# EAGLE design sub_board (EAGLE 7.3.0)
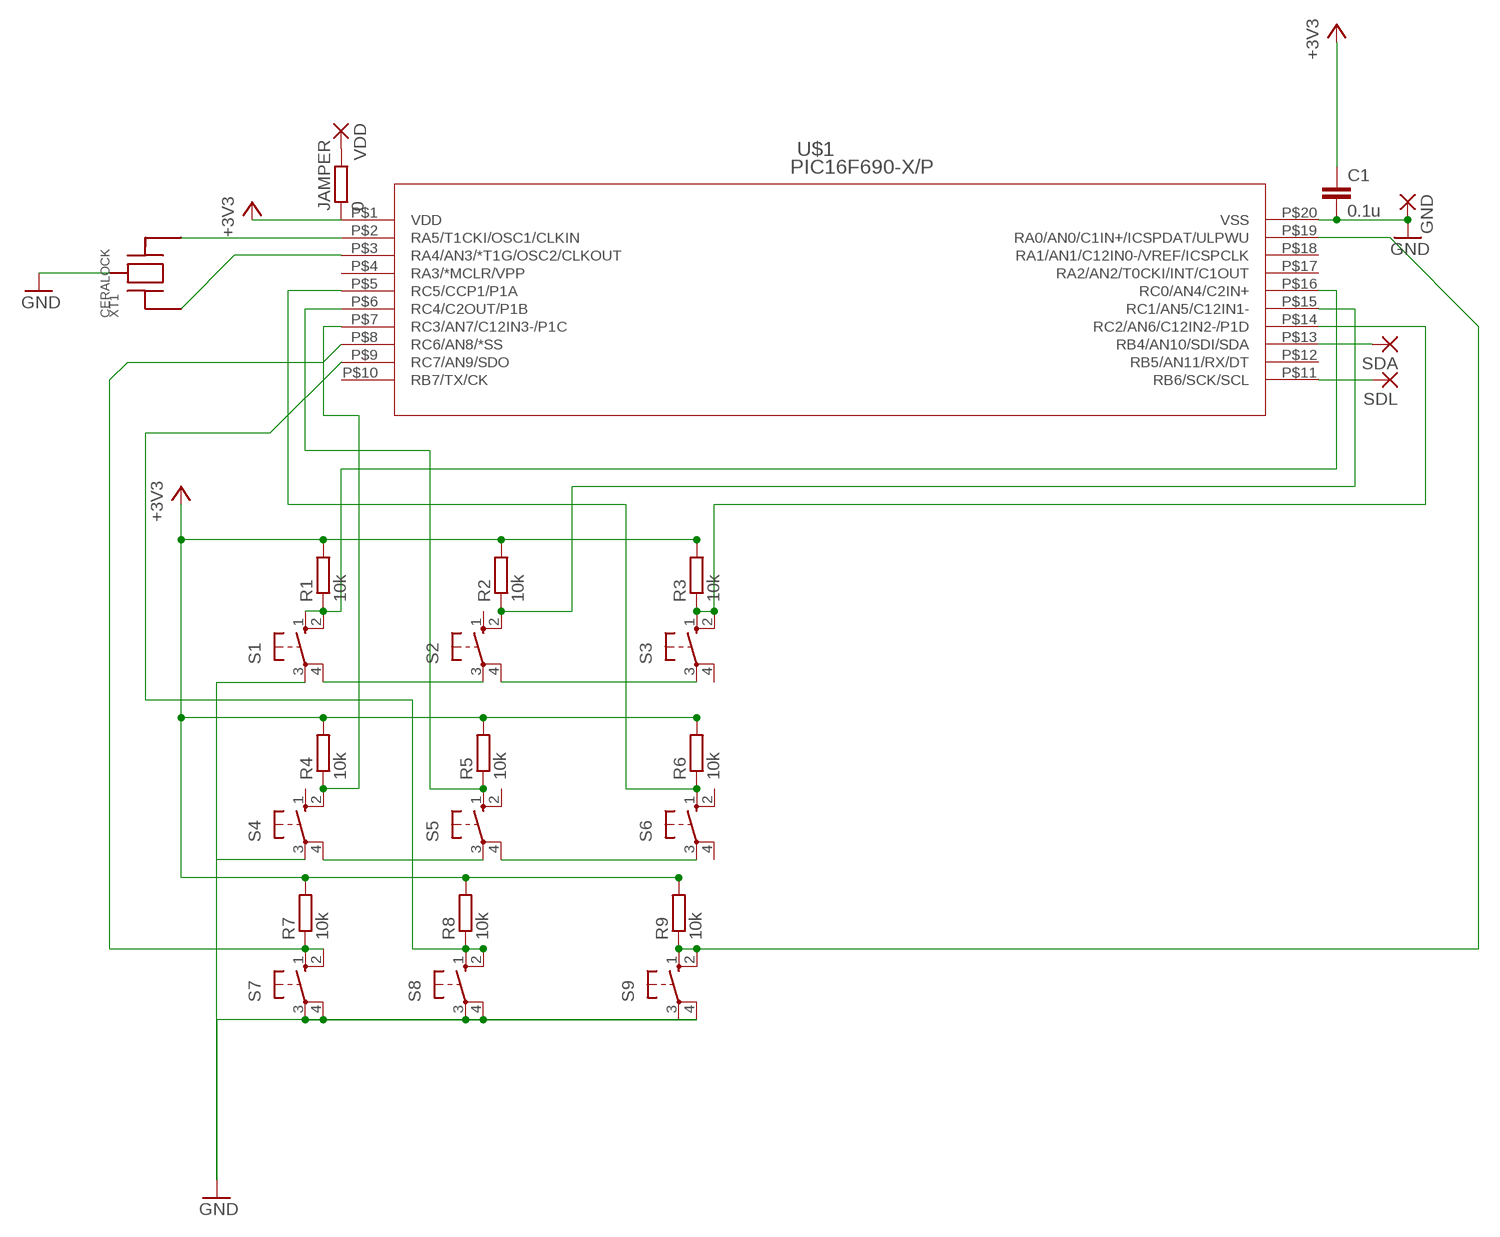
[diagram p0: schematic, sheet 1]

## Parts
C1  0.1u  C-EU025-024X044  [C025-024X044]
GND  2,15/1,0  [2,15/1,0]
JAMPER  0  R-EU_0207/10  [0207/10]
R1  10k  R-EU_0204/7  [0204/7]
R2  10k  R-EU_0204/7  [0204/7]
R3  10k  R-EU_0204/7  [0204/7]
R4  10k  R-EU_0204/7  [0204/7]
R5  10k  R-EU_0204/7  [0204/7]
R6  10k  R-EU_0204/7  [0204/7]
R7  10k  R-EU_0204/7  [0204/7]
R8  10k  R-EU_0204/7  [0204/7]
R9  10k  R-EU_0204/7  [0204/7]
S1  10-XX  [B3F-10XX]
S2  10-XX  [B3F-10XX]
S3  10-XX  [B3F-10XX]
S4  10-XX  [B3F-10XX]
S5  10-XX  [B3F-10XX]
S6  10-XX  [B3F-10XX]
S7  10-XX  [B3F-10XX]
S8  10-XX  [B3F-10XX]
S9  10-XX  [B3F-10XX]
SDA  2,15/1,0  [2,15/1,0]
SDL  2,15/1,0  [2,15/1,0]
U$1  PIC16F690-X/P  [PDIP20_300MC]
VDD  2,15/1,0  [2,15/1,0]
XT1  CERALOCK  [CERALOCK]

## Nets
+3V3: C1.1 JAMPER.1 R1.2 R2.2 R3.2 R4.2 R5.2 R6.2 R7.2 R8.2 R9.2 U$1.P$1(VDD)
GND: C1.2 GND.1(P) S1.3(P) S4.3(P) S7.3(P) S7.4(P1) S8.3(P) S8.4(P1) S9.3(P) S9.4(P1) U$1.P$20(VSS) XT1.P$2
N$1: R1.1 S1.1(S) S1.2(S1) U$1.P$16(RC0/AN4/C2IN+)
N$2: R5.1 S5.1(S) U$1.P$6(RC4/C2OUT/P1B)
N$3: JAMPER.2 VDD.1(P)
N$4: R8.1 S8.1(S) S8.2(S1) U$1.P$9(RC7/AN9/SDO)
N$5: R2.1 S2.2(S1) U$1.P$15(RC1/AN5/C12IN1-)
N$6: R3.1 S3.1(S) S3.2(S1) U$1.P$14(RC2/AN6/C12IN2-/P1D)
N$7: S4.4(P1) S5.3(P)
N$8: S5.4(P1) S6.3(P)
N$9: S1.4(P1) S2.3(P)
N$10: R6.1 S6.1(S) U$1.P$5(RC5/CCP1/P1A)
N$12: S2.4(P1) S3.3(P)
N$13: U$1.P$3(RA4/AN3/*T1G/OSC2/CLKOUT) XT1.P$1
N$14: U$1.P$2(RA5/T1CKI/OSC1/CLKIN) XT1.P$3
N$15: SDA.1(P) U$1.P$13(RB4/AN10/SDI/SDA)
N$16: SDL.1(P) U$1.P$11(RB6/SCK/SCL)
N$17: R4.1 S4.2(S1) U$1.P$7(RC3/AN7/C12IN3-/P1C)
N$26: R9.1 S9.1(S) S9.2(S1) U$1.P$19(RA0/AN0/C1IN+/ICSPDAT/ULPWU)
N$27: R7.1 S7.1(S) S7.2(S1) U$1.P$8(RC6/AN8/*SS)
Unconnected: S2.1(S) S3.4(P1) S4.1(S) S5.2(S1) S6.2(S1) S6.4(P1) U$1.P$4(RA3/*MCLR/VPP) U$1.P$10(RB7/TX/CK) U$1.P$12(RB5/AN11/RX/DT) U$1.P$17(RA2/AN2/T0CKI/INT/C1OUT) U$1.P$18(RA1/AN1/C12IN0-/VREF/ICSPCLK)

## Library data of the parts
C1 = rcl:C-EU: CAPACITOR, European symbol
GND SDA SDL VDD = wirepad:2,15/1,0: THROUGH-HOLE PAD
JAMPER R1-R9 = rcl:R-EU_: RESISTOR, European symbol
S1-S9 = switch-omron:10-XX: OMRON SWITCH; MPN: B3F-1000; OC_FARNELL: 176432; OC_NEWARK: 36M3542
U$1 = pic16f690_p:PIC16F690-X/P
XT1 = serolock:CERALOCK

## Board
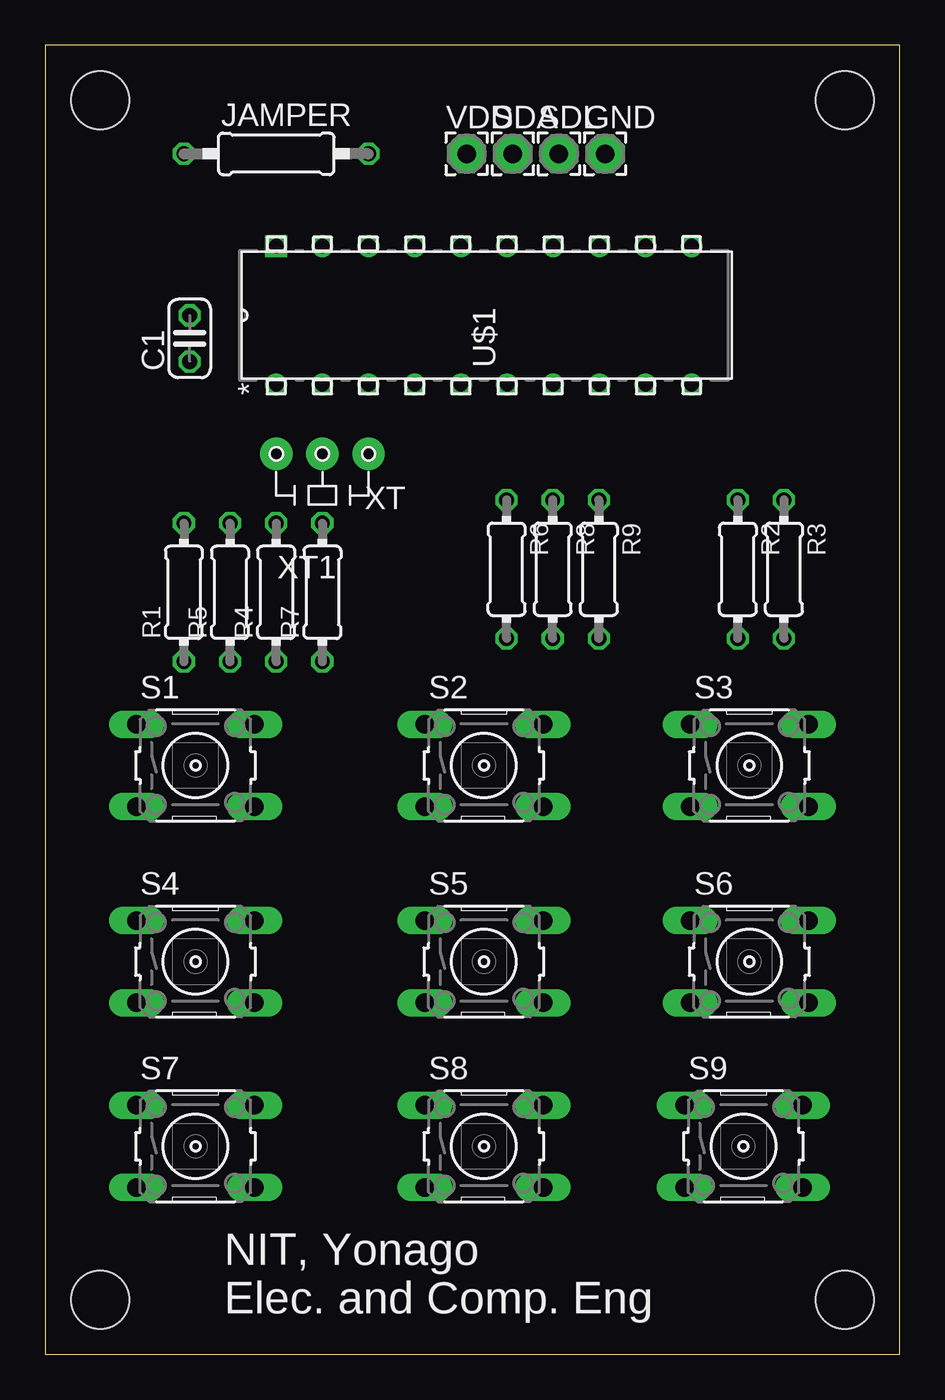
[diagram p1: board, top side]
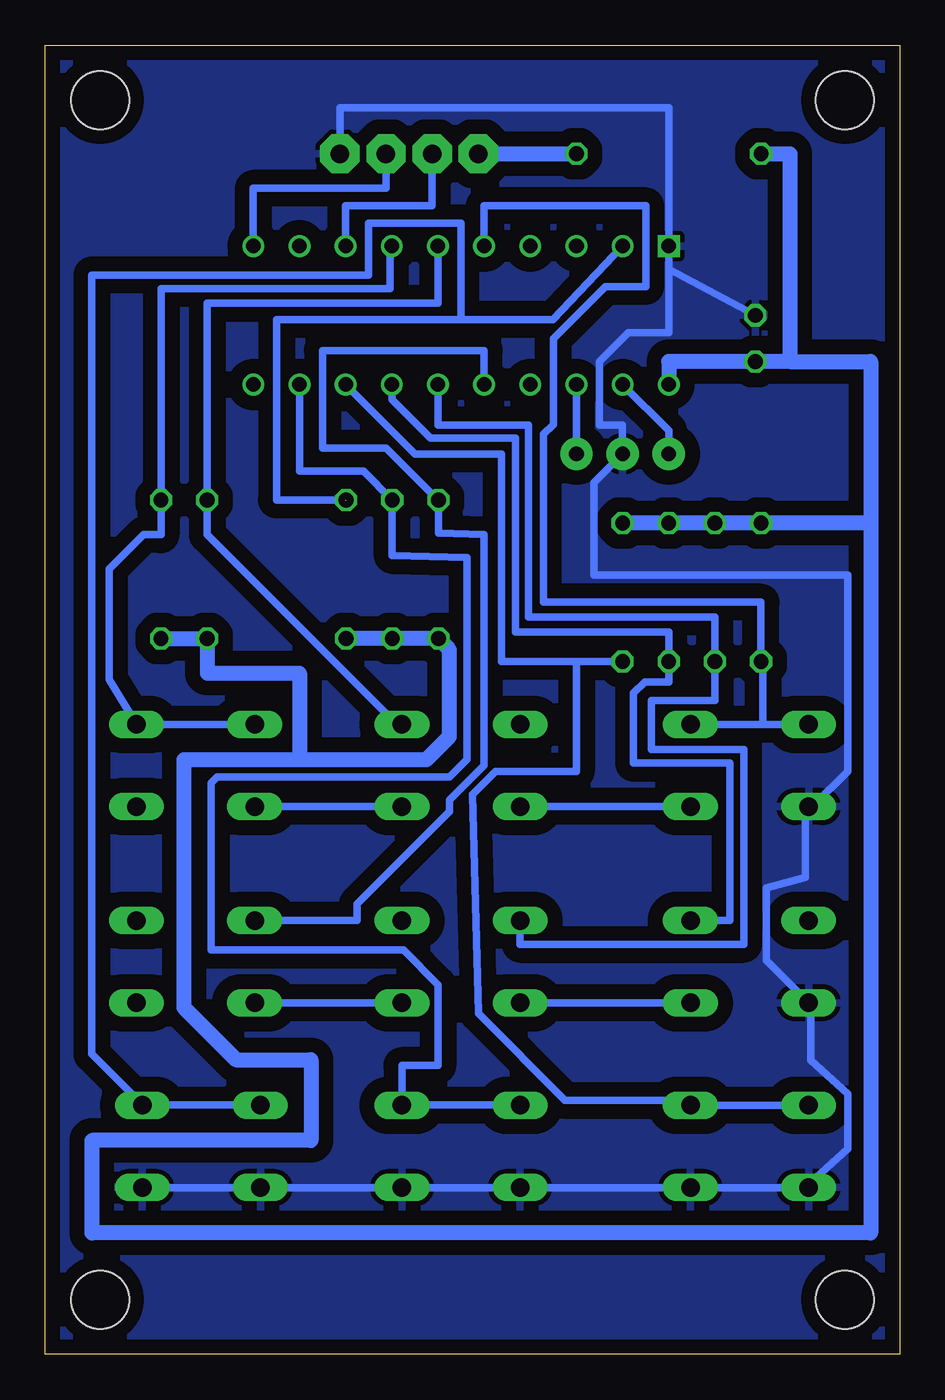
[diagram p2: board, bottom side, seen from below]

Size 47 x 72 mm. Coordinates in mm from the lower left corner, seen from the top.
Outline: 0,0 47,0 47,72 0,72 0,0
Copper layers (1*16): Top 0.035mm / dielectric 1.53mm / Bottom 0.035mm
Design rules "pban_5mil-l2": minimum track width 5mil, minimum drill 0.3mm, track to track 5mil, track to pad 0.229mm, pad to pad 5mil, via to via 5mil, smd to smd 5mil, copper to edge 0.5mm, drill to drill 0.5mm, minimum pad ring 0.15mm, minimum via ring 0.15mm, stop-mask expansion 4mil, vias tented up to drill 0.35mm, thermal gap 10mil
Holes 3.2 mm at 3,69 44,69 44,3 3,3

### Footprints (pad centres in the part's own frame; a part is rotated, then mirrored left to right if it is on the bottom)
C025-024X044 = drill 0.813 octagon: 1 -1.27,0; 2 1.27,0
2,15/1,0 = drill 1.016 pad 2.159 octagon: 1 0,0
0207/10 = drill 0.813 octagon: 1 -5.08,0; 2 5.08,0
0204/7 = drill 0.813 octagon: 1 -3.81,0; 2 3.81,0
B3F-10XX = drill 1.016 long: 1 -3.251,2.261; 2 3.251,2.261; 3 -3.251,-2.261; 4 3.251,-2.261
PDIP20_300MC = drill 0.8: P$1 -7.62,22.86; P$2 -7.62,20.32; P$3 -7.62,17.78; P$4 -7.62,15.24; P$5 -7.62,12.7; P$6 -7.62,10.16; P$7 -7.62,7.62; P$8 -7.62,5.08; P$9 -7.62,2.54; P$10 -7.62,0; P$11 0,0; P$12 0,2.54; P$13 0,5.08; P$14 0,7.62; P$15 0,10.16; P$16 0,12.7; P$17 0,15.24; P$18 0,17.78; P$19 0,20.32 | drill 0.8 square: P$20 0,22.86
CERALOCK = drill 0.813 pad 1.778: P$1 -2.54,-3.81; P$2 0,-3.81; P$3 2.54,-3.81

### Placement (x,y rotation side)
C1  7.94,55.88 90 top
GND  30.8,66.04 0 top
JAMPER  12.7,66.04 0 top
R1  7.62,41.91 90 top
R2  38.1,43.18 270 top
R3  40.64,43.18 270 top
R4  12.7,41.91 90 top
R5  10.16,41.91 90 top
R6  25.37,43.18 270 top
R7  15.24,41.91 90 top
R8  27.91,43.18 270 top
R9  30.45,43.18 270 top
S1  8.26,32.38 0 top
S2  24.13,32.38 0 top
S3  38.73,32.38 0 top
S4  8.26,21.59 0 top
S5  24.13,21.59 0 top
S6  38.73,21.59 0 top
S7  8.26,11.43 0 top
S8  24.13,11.43 0 top
S9  38.42,11.43 0 top
SDA  25.72,66.04 0 top
SDL  28.26,66.04 0 top
U$1  35.56,60.96 90 top
VDD  23.18,66.04 0 top
XT1  15.24,45.72 180 top

### Tracks (layer width: path | path; a pad name or v marks a point on that pad's centre or on a via)
+3V3
  Bottom 0.406: R1.2 R5.2 R4.2 R7.2
  Bottom 0.813: JAMPER.1 6.03,66.04 6.03,54.61 | 6.03,54.61 C1.1 12.7,54.61 U$1.P$1 | 6.03,54.61 1.59,54.61 1.59,45.72 | 1.59,45.72 1.59,6.67 44.45,6.67 44.45,11.75 32.38,11.75 32.38,16.19 36.51,16.19 39.37,19.05 39.37,32.7 33.02,32.7 | 1.59,45.72 R7.2 | 33.02,32.7 26.04,32.7 24.77,33.97 24.77,38.76 R6.2 R8.2 R9.2 | R3.2 R2.2 38.1,37.47 33.02,37.47 33.02,32.7
GND
  Bottom 0.406: S9.4 41.45,9.14 35.36,9.14 S9.3 35.05,9.14 27.43,9.14 S8.4 27.13,9.14 21.03,9.14 S8.3 20.73,9.14 11.58,9.14 S7.4 11.28,9.14 5.18,9.14 S7.3 4.88,9.45 2.85,11.28 2.85,14.33 4.88,16.15 4.88,19.2 S4.3 7.33,21.65 7.33,25.65 5.18,26.21 5.18,29.87 S1.3 4.76,30.16 2.86,32.07 2.86,42.86 16.83,42.86 16.83,47.94 XT1.P$2 15.24,51.12 16.51,51.12 16.51,54.61 14.92,56.2 12.7,56.2 12.7,59.69 | GND.1 30.8,68.58 12.7,68.58 U$1.P$20 12.7,59.69 | 12.7,59.69 C1.2
  pour Bottom (isolate 0.813): 0,72.07 0,0 46.99,0 46.99,71.75
N$1
  Bottom 0.406: U$1.P$16 22.86,63.18 13.97,63.18 13.97,58.74 16.19,58.74 19.05,55.88 19.05,51.14 19.58,50.62 19.58,41.36 7.62,41.36 R1.1 7.52,38.1 7.52,34.65 | S1.1 7.52,34.65 | 7.52,34.65 S1.2
N$2
  Bottom 0.406: S5.1 20.88,22.54 8.57,22.54 8.57,33.27 13.65,33.27 13.65,35.97 10.16,35.97 R5.1 10.16,40.55 20.42,40.55 20.42,51.12 25.4,51.12 U$1.P$6
N$3
  Bottom 0.813: VDD.1 JAMPER.2
N$4
  Bottom 0.406: S8.1 21.03,13.72 27.13,13.72 S8.2 27.38,15.88 25.4,15.88 25.4,20.32 27.3,22.23 37.87,22.23 37.87,31.43 37.55,31.75 24.77,31.75 23.81,32.7 23.81,43.81 27.91,43.94 R8.1 29.5,48.58 33.02,48.58 U$1.P$9
N$5
  Bottom 0.406: U$1.P$15 25.4,57.81 38.1,57.81 R2.1 38.1,45.09 27.94,34.92 S2.2
N$6
  Bottom 0.406: U$1.P$14 28.04,60.96 28.04,58.61 40.64,58.61 R3.1 40.64,45.09 41.59,45.09 43.5,43.18 43.5,37.11 S3.2 S3.1
N$7
  Bottom 0.406: S4.4 S5.3
N$8
  Bottom 0.406: S5.4 S6.3
N$9
  Bottom 0.406: S1.4 S2.3
N$10
  Bottom 0.406: U$1.P$5 22.86,55.22 31.75,55.22 31.75,49.85 28.26,49.85 25.4,46.99 R6.1 25.38,45.16 22.86,45.09 22.86,32.38 24.77,30.48 24.77,29.84 29.84,24.77 29.84,23.85 S6.1
N$12
  Bottom 0.406: S2.4 S3.3
N$13
  Bottom 0.406: XT1.P$1 U$1.P$3
N$14
  Bottom 0.406: U$1.P$2 12.7,50.8 XT1.P$3
N$15
  Bottom 0.406: U$1.P$13 30.48,63.18 25.72,63.18 SDA.1
N$16
  Bottom 0.406: SDL.1 28.26,64.14 35.56,64.14 U$1.P$11
N$17
  Bottom 0.406: U$1.P$7 27.94,52.53 25.81,50.39 21.13,50.39 21.13,39.74 12.7,39.74 R4.1 12.7,36.98 14.02,36.98 14.63,36.37 14.63,32.51 9.35,32.51 9.35,23.85 S4.2
N$26  (1 unrouted)
  Bottom 0.406: S9.1 35.36,13.72 41.45,13.72 S9.2 41.91,13.97 44.45,16.51 44.45,59.37 29.21,59.37 29.21,62.23 24.13,62.23 24.13,56.92 | 24.13,56.92 34.29,56.92 34.29,46.99 30.48,46.99 | 24.13,56.92 19.07,56.92 U$1.P$19
N$27
  Bottom 0.406: 17.78,38.1 R7.1 | 17.78,38.1 17.78,32.07 22.23,32.07 23.5,30.8 23.18,18.73 18.41,13.97 12.06,13.97 S7.2 S7.1 | U$1.P$8 26.67,49.53 21.91,49.53 21.91,38.1 17.78,38.1

### Text on the board
tPlace: NIT, Yonago / Elec. and Comp. Eng